# EAGLE design esp32_programmer_revA (EAGLE 7.3.0)
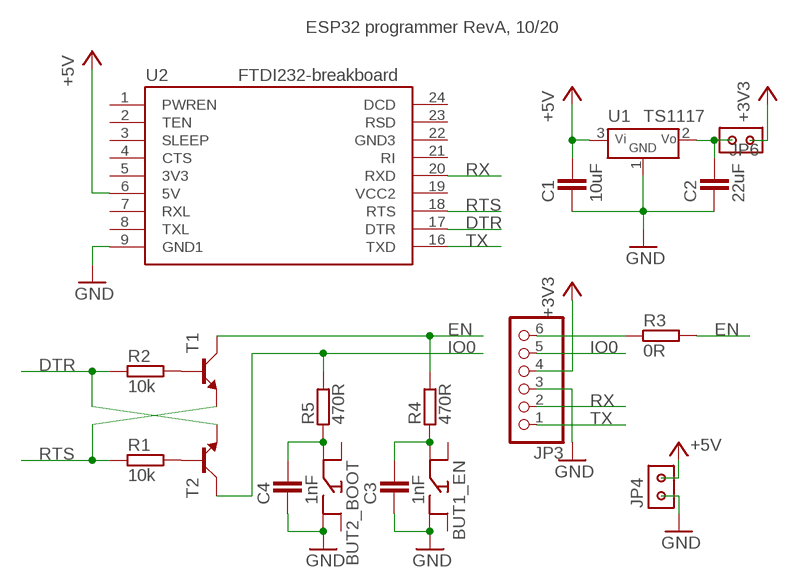
[diagram p0: schematic, sheet 1]

## Parts
BUT1_EN  BUTTON'SMD'  [BUTTON_SMD]
BUT2_BOOT  BUTTON'SMD'  [BUTTON_SMD]
C1  10uF  C-CERAMIC'SMD'  [C0805]
C2  22uF  C-CERAMIC'SMD'  [C0805]
C3  1nF  C-CERAMIC'SMD'  [C0805]
C4  1nF  C-CERAMIC'SMD'  [C0805]
JP3  PINHD-1X6  [1X06]
JP4  PINHD-2X1  [PINHD-2X1]
JP6  PINHD-2X1  [PINHD-2X1]
R1  10k  R'2'  [R0805]
R2  10k  R'2'  [R0805]
R3  0R  R'2'  [R0805]
R4  470R  R'2'  [R0805]
R5  470R  R'2'  [R0805]
T1  TRAN_NPN'BC817'  [SOT23]
T2  TRAN_NPN'BC817'  [SOT23]
U1  TS1117  V_STAB'TS1117'  [SOT223]
U2  FTDI232-BREAKBOARD-SIMPLE  [FTDI232-BRAKBOARD-SIMPLE]

## Nets
+3V3: JP3.4 JP6.2
+5V: C1.2 JP4.1 U1.3(VIN) U2.6(5V)
DTR: R2.1 T2.2(E) U2.17(DTR)
EN: R3.2 R4.2 T1.3(C)
GND: BUT1_EN.3 BUT2_BOOT.3 C1.1 C2.1 C3.1 C4.1 JP3.3 JP4.2 U1.1(GND) U2.9(GND1)
IO0: JP3.5 R5.2 T2.3(C)
N$1: R2.2 T1.1(B)
N$2: R1.2 T2.1(B)
N$3: BUT1_EN.2 C3.2 R4.1
N$4: JP3.6 R3.1
N$5: BUT2_BOOT.2 C4.2 R5.1
N$11: C2.2 JP6.1 U1.2(VOUT)
RTS: R1.1 T1.2(E) U2.18(RTS)
RX: JP3.2 U2.20(RXD)
TX: JP3.1 U2.16(TXD)
Unconnected: BUT1_EN.1 BUT1_EN.4 BUT2_BOOT.1 BUT2_BOOT.4 U2.1(PWREN) U2.2(TEN) U2.3(SLEEP) U2.4(CTS) U2.7(RXL) U2.8(TXL) U2.21(RI) U2.23(RSD) U2.24(DCD)

## Notes on the sheet
- ESP32 programmer RevA, 10/20

## Power pins joined to a net without a drawn wire
3V3: U2.5(3V3)
GND3: U2.22(GND3)
VCC2: U2.19(VCC2)

## Library data of the parts
BUT1_EN BUT2_BOOT = 1_domaci:BUTTON
C1-C4 = 1_domaci:C-CERAMIC
JP3 = 1_domaci:PINHD-1X6: PIN HEADER
JP4 JP6 = 1_domaci:PINHD-2X1
R1-R5 = 1_domaci:R
T1 T2 = 1_domaci:TRAN_NPN
U1 = 1_domaci:V_STAB
U2 = 1_domaci:FTDI232-BREAKBOARD-SIMPLE

## Board
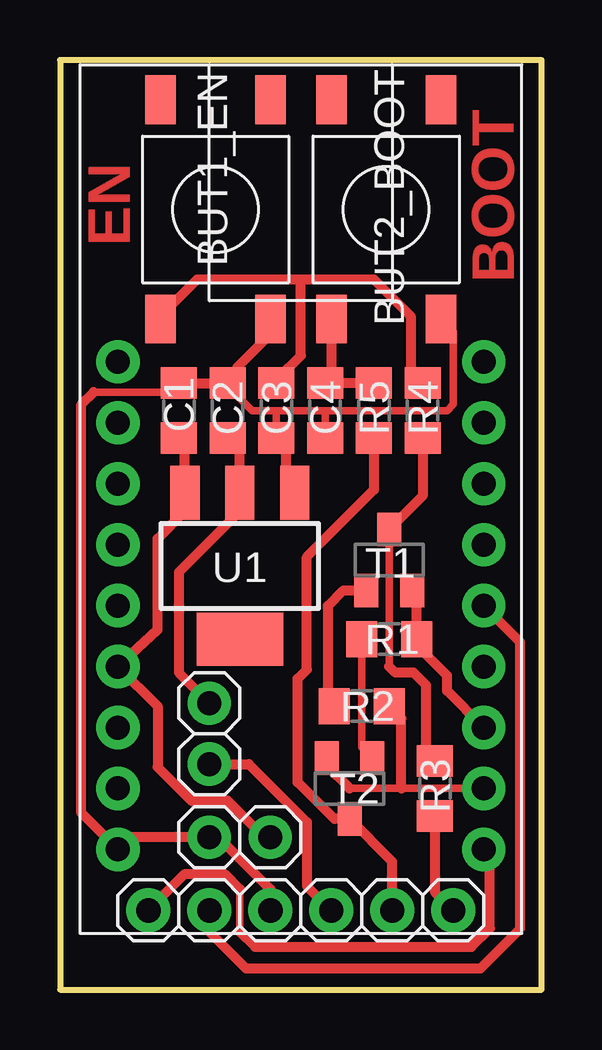
[diagram p1: board, top side]

Size 20.07 x 38.73 mm. Coordinates in mm from the lower left corner, seen from the top.
Outline: 0,0 20.07,0 20.07,38.73 0,38.73 0,0
Copper layers (1*16): Top 0.035mm / dielectric 1.5mm / Bottom 0.035mm
Design rules "default *": minimum track width 10mil, minimum drill 24mil, track to track 8mil, track to pad 8mil, pad to pad 8mil, via to via 8mil, smd to smd 8mil, copper to edge 40mil, drill to drill 8mil, minimum pad ring 10mil, minimum via ring 8mil, stop-mask expansion 4mil, vias tented up to drill 0mil, thermal gap 10mil

### Footprints (pad centres in the part's own frame; a part is rotated, then mirrored left to right if it is on the bottom)
BUTTON_SMD = smd 2.032 x 1.27: 1 -4.572,-2.286; 2 4.572,-2.286; 3 4.572,2.286; 4 -4.572,2.286
C0805 = smd 1.3 x 1.5: 1 -1.143,0; 2 1.143,0
1X06 = drill 1.016: 1 -6.35,0; 2 -3.81,0; 3 -1.27,0; 4 1.27,0; 5 3.81,0; 6 6.35,0
PINHD-2X1 = drill 1 pad 1.676: 1 -1.27,0; 2 1.27,0
R0805 = smd 1.3 x 1.5: 1 -1.143,0; 2 1.143,0
SOT23 = smd 1 x 1.4: 1 -0.953,-1.27; 2 0.953,-1.27; 3 0,1.27
SOT223 = smd 1.219 x 2.235: 1 -2.286,-3.048; 2 0,-3.048; 3 2.286,-3.048 | smd 3.6 x 2.2: 4 0,3.048
FTDI232-BRAKBOARD-SIMPLE = drill 1: 1 -7.62,6.35; 2 -7.62,3.81; 3 -7.62,1.27; 4 -7.62,-1.27; 5 -7.62,-3.81; 6 -7.62,-6.35; 7 -7.62,-8.89; 8 -7.62,-11.43; 9 -7.62,-13.97; 16 7.62,-13.97; 17 7.62,-11.43; 18 7.62,-8.89; 19 7.62,-6.35; 20 7.62,-3.81; 21 7.62,-1.27; 22 7.62,1.27; 23 7.62,3.81; 24 7.62,6.35

### Placement (x,y rotation side)
BUT1_EN  6.48,32.51 270 top
BUT2_BOOT  13.59,32.51 270 top
C1  4.95,24.13 270 top
C2  6.98,24.13 270 top
C3  9.02,24.13 90 top
C4  11.05,24.13 90 top
JP3  10.03,3.3 0 top
JP4  7.49,6.35 180 top
JP6  6.22,10.67 270 top
R1  13.72,14.6 180 top
R2  12.57,11.81 180 top
R3  15.62,8.38 90 top
R4  15.11,24.13 270 top
R5  13.08,24.13 270 top
T1  13.72,17.91 0 top
T2  12.06,8.38 180 top
U1  7.49,17.65 180 top
U2  10.03,19.81 0 top

### Tracks (layer width: path | path; a pad name or v marks a point on that pad's centre or on a via)
+3V3
  Top 0.406: JP3.4 10.29,4.32 10.29,6.98 7.87,9.4 JP6.2
+5V
  Top 0.406: JP4.1 8.51,6.35 6.98,7.87 5.46,7.87 4.06,9.27 4.06,11.81 U2.6 4.06,14.99 4.06,18.8 5.21,19.94 U1.3 5.21,22.73 C1.2
DTR
  Top 0.305: U2.17 14.22,8.38 12.06,8.38
  Top 0.406: 14.22,8.38 14.22,11.3 R2.1 | 12.06,8.38 11.11,9.33 T2.2
EN
  Top 0.305: T1.3 13.72,13.46
  Top 0.406: 13.72,13.46 13.97,13.21 14.73,13.21 15.24,12.7 15.24,9.91 R3.2 | R4.2 15.11,20.57 T1.3
GND
  Top 0.305: 1.4,24.89 4.57,24.89 | 11.05,24.13 16.13,24.13 16.38,24.38 16.38,27.43 BUT2_BOOT.3 | 11.05,24.13 9.02,24.13 | 9.02,24.13 8,24.13 6.98,25.15 | C3.1 9.02,24.13 | C4.1 11.05,24.13
  Top 0.406: JP3.3 8.76,4.19 6.6,6.35 JP4.2 2.92,6.35 U2.9 0.89,7.37 0.89,24.38 1.4,24.89 | 4.57,24.89 4.95,25.15 C1.1 C2.1 | C2.1 7.37,25.27 7.37,25.91 8.76,27.3 BUT1_EN.3 | C2.1 6.98,25.15 | C3.1 9.4,22.61 9.4,21.08 U1.1
IO0
  Top 0.406: JP3.5 13.84,5.33 T2.3 11.43,7.11 9.91,8.64 9.91,12.95 10.29,13.33 10.29,18.03 13.08,20.83 R5.2
N$1
  Top 0.406: R2.2 11.18,12.06 11.18,16 11.81,16.64 T1.1
N$2
  Top 0.305: R1.2 12.57,10.1 T2.1
N$3
  Top 0.406: 10.03,29.59 5.71,29.59 4.32,28.19 BUT1_EN.2 | 10.03,29.59 13.08,29.59 14.6,28.07 14.6,25.65 14.99,25.27 R4.1 | C3.2 9.02,25.53 9.14,25.53 10.03,26.42 10.03,29.59
N$4
  Top 0.406: R3.1 15.62,4.06 JP3.6
N$5
  Top 0.406: BUT2_BOOT.2 11.3,25.53 C4.2 R5.1
N$11
  Top 0.406: JP6.1 4.95,13.21 4.95,17.4 7.49,19.94 U1.2 7.49,22.73 C2.2
RTS
  Top 0.406: U2.18 16.13,12.45 16.13,13.08 14.86,14.35 R1.1 14.86,16.45 T1.2
RX
  Top 0.406: JP3.2 6.22,2.41 7.75,0.89 17.53,0.89 19.18,2.54 19.18,14.48 U2.20
TX
  Top 0.305: 7.49,4.19 7.49,2.41
  Top 0.406: JP3.1 5.21,4.83 6.86,4.83 7.49,4.19 | 7.49,2.41 8.13,1.78 17.15,1.78 17.91,2.54 17.91,5.59 U2.16

### Text on the board
Top: EN | BOOT